# Altium project Actuator_Base_Board.PrjPcb
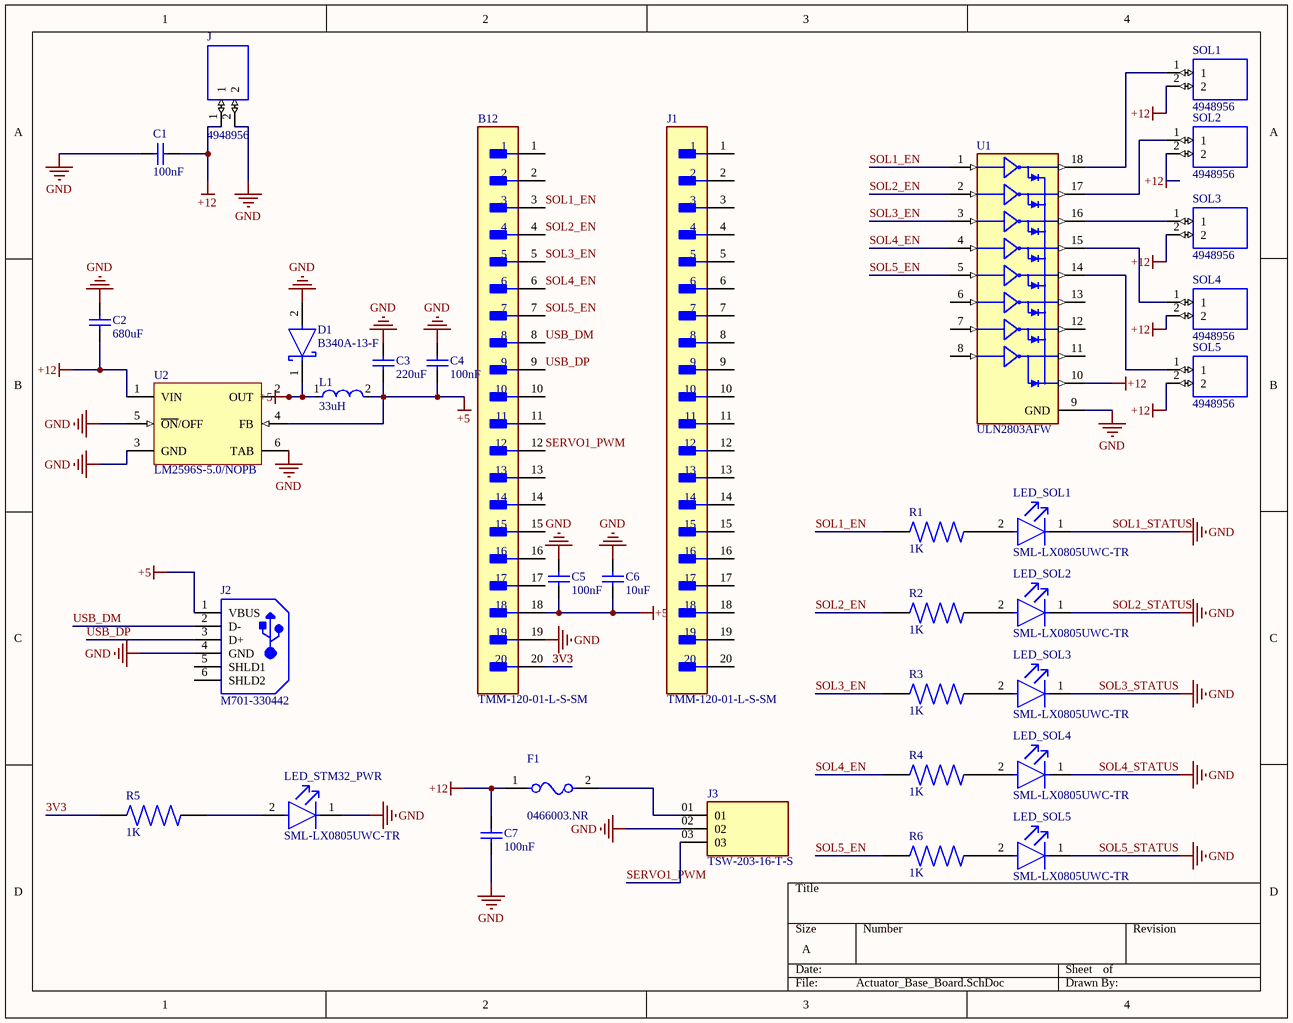
[diagram p0: Actuator_Base_Board.SchDoc]
1 sheet, 34 parts. Net scope: global (net labels, ports and power ports of the same name join across sheets).
Board file: Actuator_Base_Board.PcbDoc

## Sheet Actuator_Base_Board.SchDoc
size A; SheetNumber: 1; SheetTotal: 1

### Parts
B12  TMM-120-01-L-S-SM  [FP-TMM-120-01-L-S-SM-MFG]
C1  100nF  [CAPC2013X145X48LL20T23]
C2  680uF  [CAPC2013X145X48LL20T23]
C3  220uF  [CAPC2013X145X48LL20T23]
C4  100nF  [CAPC2013X145X48LL20T23]
C5  100nF  [CAPC2013X145X48LL20T23]
C6  10uF  [CAPC2013X145X48LL20T23]
C7  100nF  [CAPC2013X145X48LL20T23]
D1  B340A-13-F  [FP-SMA-MFG]
F1  0466003.NR  [FP-0466-MFG]
J  4948956  [SHDR2W100P0X500_1X2_1000X750X1]
J1  TMM-120-01-L-S-SM  [FP-TMM-120-01-L-S-SM-MFG]
J2  M701-330442  [HRWN-M701-330442_V]
J3  TSW-203-16-T-S  [SAMTEC_TSW-203-16-T-S]
L1  33uH  [FP-NR4018-MFG]
LED_SOL1  SML-LX0805UWC-TR  [FP-SML-LX0805UWC-TR-MFG]
LED_SOL2  SML-LX0805UWC-TR  [FP-SML-LX0805UWC-TR-MFG]
LED_SOL3  SML-LX0805UWC-TR  [FP-SML-LX0805UWC-TR-MFG]
LED_SOL4  SML-LX0805UWC-TR  [FP-SML-LX0805UWC-TR-MFG]
LED_SOL5  SML-LX0805UWC-TR  [FP-SML-LX0805UWC-TR-MFG]
LED_STM32_PWR  SML-LX0805UWC-TR  [FP-SML-LX0805UWC-TR-MFG]
R1  1K  [RES_ERJU02F1543X]
R2  1K  [RES_ERJU02F1543X]
R3  1K  [RES_ERJU02F1543X]
R4  1K  [RES_ERJU02F1543X]
R5  1K  [RES_ERJU02F1543X]
R6  1K  [RES_ERJU02F1543X]
SOL1  4948956  [SHDR2W100P0X500_1X2_1000X750X1]
SOL2  4948956  [SHDR2W100P0X500_1X2_1000X750X1]
SOL3  4948956  [SHDR2W100P0X500_1X2_1000X750X1]
SOL4  4948956  [SHDR2W100P0X500_1X2_1000X750X1]
SOL5  4948956  [SHDR2W100P0X500_1X2_1000X750X1]
U1  ULN2803AFW  [SOIC127P1030X265-18N]
U2  LM2596S-5.0/NOPB  [KTT0005B_L]

### Nets
+5: B12.18 C3.2 C4.1 C5.1 C6.1 D1.1(C) J2.1(VBUS) L1.1 L1.2 U2.2(OUT) U2.4(FB)
+12: C1.1 C2.1 C7.2 F1.1 J.1 SOL1.2 SOL2.2 SOL3.2 SOL4.2 SOL5.2 U1.10(COMMON) U2.1(VIN)
SOL1_STATUS: B12.19 C1.2 C2.2 C3.1 C4.2 C5.2 C6.2 C7.1 D1.2(A) J.2 J2.4(GND) J3.02 LED_SOL1.1(C) LED_SOL2.1(C) LED_SOL3.1(C) LED_SOL4.1(C) LED_SOL5.1(C) LED_STM32_PWR.1(C) U1.9(GND) U2.3(GND) U2.5(~{ON}/OFF) U2.6(TAB)  [also labelled GND, SOL2_STATUS, SOL3_STATUS, SOL4_STATUS, SOL5_STATUS]
3V3: B12.20 R5.1
SERVO1_PWM: B12.12 J3.03
SOL1_EN: B12.3 R1.1 U1.1(I1)
SOL2_EN: B12.4 R2.1 U1.2(I2)
SOL3_EN: B12.5 R3.1 U1.3(I3)
SOL4_EN: B12.6 R4.1 U1.4(I4)
SOL5_EN: B12.7 R6.1 U1.5(I5)
USB_DM: B12.8 J2.2(D-)
USB_DP: B12.9 J2.3(D+)
NetF1_2: F1.2 J3.01
NetLED_SOL1_2: LED_SOL1.2(A) R1.2
NetLED_SOL2_2: LED_SOL2.2(A) R2.2
NetLED_SOL3_2: LED_SOL3.2(A) R3.2
NetLED_SOL4_2: LED_SOL4.2(A) R4.2
NetLED_SOL5_2: LED_SOL5.2(A) R6.2
NetLED_STM32_PWR_2: LED_STM32_PWR.2(A) R5.2
NetSOL1_1: SOL1.1 U1.18(O1)
NetSOL2_1: SOL2.1 U1.17(O2)
NetSOL3_1: SOL3.1 U1.16(O3)
NetSOL4_1: SOL4.1 U1.15(O4)
NetSOL5_1: SOL5.1 U1.14(O5)

Not connected (* = marked no-connect by the designer): B12 1 2 10 11 13 14 15 16 17; J1 1 2 3 4 5 6 7 8 9 10 11 12 13 14 15 16 17 18 19 20; J2 5(SHLD1) 6(SHLD2); U1 6(I6) 7(I7) 8(I8) 11(O8) 12(O7) 13(O6)

### Library data of the parts
B12 J1 = CMP-02766-001494-1: 2MM TERMINAL STRIP; Connector Type: Header; Gender: Male; Number of Positions: 20; Contact Type: Male Pin; Min Operating Temperature: -55°C; Max Operating Temperature: 125°C; Flammability Rating: UL94 V-0; REACH SVHC: No SVHC; Lead Free: Lead Free; Fastening Type: Pull; Mount: Surface Mount; Contact Plating: Gold; Contact Finish - Mating: GOLD; Insulation Material: Polymer; Number of Contacts: 20; Insulation Color: Black; Contact Shape: Square; Termination: Solder; Number of Rows: 1; Series: TMM; Packaging: Rail/Tube; Contact Material: Bronze
C1-C7 = CMP-2007-03205-1: Manufacturer: Vitramon; Part Number: VJ0805Y682KXAMT
D1 = CMP-1667-00003-3: DIODE SCHOTTKY 40V 3A SMA; Max Forward Surge Current (Ifsm): 80A; Forward Voltage: 500mV; Polarity: Standard; Max Reverse Current: 500uA; Capacitance: 250pF; Element Configuration: Single; Mount: Surface Mount; Output Current: 3A; Radiation Hardening: No; Width: 2.92mm; Current Rating: 3A; Termination: SMD/SMT; Voltage: 40V; Series: -; Max Operating Temperature: 125°C; Current: 3A; Max Repetitive Reverse Voltage (Vrrm): 40V; Min Operating Temperature: -55°C; REACH SVHC: No SVHC; Number of Pins: 2; Average Rectified Current: 3A; Contact Plating: Tin; RoHS Compliant: Yes; Max Reverse Voltage (DC): 40V; Packaging: Tape and Reel; Height: 2.3mm; Length: 4.6mm; Case/Package: SMA; Weight: 0.002258oz; Peak Non-Repetitive Surge Current: 80A; Package Quantity: 5000; Lead Free: Lead Free; Forward Current: 3A; Voltage Rating (DC): 40V
F1 = CMP-08605-000054-1_1: FUSE BOARD MNT 3A 32VAC/VDC 1206; Manufacturer: Littelfuse; Fuse Interrupt Ac Current: 50A; Fuse Voltage Drop: 75.99mV; Max Fuse Ac Voltage: 32V; Fuse I2T: 0.576A2Sec; Resistance: 0.019Ω; Fuse Blow Speed: Fast; Value: 0.019Ω; ComponentLink2Description: Datasheet; Fuse Current: 3A; RoHS: TRUE; Mouser Description: Surface Mount Fuses 32V 3A VFA Slimline; Height: 0.66mm; Octopart: https://octopart.com/0466003.nr-littelfuse-565175; Package: 0466; Fuse Interrupt Dc Current: 50A; Manufacturer Part Number: 0466003.NR; Temperature Range Low: -55°C; ComponentLink2URL: https://www.littelfuse.com/~/media/electronics/datasheets/fuses/littelfuse_fuse_466_datasheet.pdf.pdf; Digikey Description: FUSE BOARD MNT 3A 32VAC/VDC 1206; Voltage Rating: 32V; Category: Fuse; Lead Free: Yes; Device Class L2: Fuses; Automotive: No; Max Fuse Dc Voltage: 32V; Temperature Range High: +90°C; Device Class L3: unset; Device Class L1: Circuit Protection; Temperature: -55°C to +90°C
J SOL1-SOL5 = 4948956: 5.08mm Pitch Straight PCB Terminal Block with Screw Term.; Through Hole; 2 Way; MF: RS Pro; MP: 4948956; Value: *; Package: None; SnapEDA_Link: https://www.snapeda.com/parts/4948956/RS%20Pro/view-part/1278850/?ref=snap; Price: None; Availability: Unavailable
J2 = CMP-1752-00001-1: Single USB 2.0, Receptacle Connecter, B Type, 4 Position Through Hole, -55 to 85 degC, RoHS, Tray; DatasheetVersion: Oct-15; PackageDescription: USB Connecter, 4 Position Through Hole, Length 12.04 mm, Height 16.25 mm, Tail Length 3.1 mm; PackageReference: M701-330442; ComponentLink1Description: Datasheet; ComponentLink1URL: https://cdn.harwin.com/pdfs/M701-330442.pdf
L1 = CMP-14484-001019-1: SMD Power Inductors 220uH ±20% 0.17A 4.56Ω; Shielding: Shielded; DC Resistance (DCR): 4.56R; Current Rating: 170mA; Core Material: Ferrite; Saturation Current: 275mA; Self Resonant Frequency: 4MHz; Test Frequency: 100kHz; Width: 0.157inch; Mount: Surface Mount; Max Operating Temperature: 125°C; Length: 0.157inch; RoHS Compliant: Yes; Min Operating Temperature: -25°C; Case/Package: Nonstandard; Resistor Type: Wirewound; Height - Seated (Max): 0.071inch; Tolerance: 20%; Inductance: 220uH; Packaging: Tape and Reel
LED_SOL1-LED_SOL5 LED_STM32_PWR = CMP-00229-00139794-1: SML-LX0805UWC-TR White LED, 0805 Diffused, Rectangle Lens SMD package | Lumex SML-LX0805UWC-TR; NexarPartId: 139794; Approvals: CSA, UL; Lens Color: Clear, Yellow; Luminous Intensity: 150mcd; Power Rating: 120mW; Forward Current: 20mA; Forward Voltage: 3.5V; Number of LEDs: 1; Viewing Angle: 120°; RoHS: Compliant; Case/Package: 0805; Illumination Color: White; Min Operating Temperature: -40°C; Mount: Surface Mount; Max Operating Temperature: 85°C
R1-R6 = ERJU02F1543X: Value: *; Availability: Unavailable; Price: None; Package: None; MP: ERJU02F1543X
U1 = ULN2803AFW: Bipolar (BJT) Transistor Array 8 NPN Darlington 50V 500mA - 1.31W Surface Mount 18-SOP; MF: Toshiba; SnapEDA_Link: https://www.snapeda.com/parts/ULN2803AFW/Toshiba/view-part/?ref=snap; Package: SO-18 Toshiba; Value: *; MP: ULN2803AFW; Check_prices: https://www.snapeda.com/parts/ULN2803AFW/Toshiba/view-part/?ref=eda
U2 = CMP-0069-00269-3: SIMPLE SWITCHER® Power Converter 150 KHz 3A Step-Down Voltage Regulator, 5-pin TO-263, Pb-Free; Manufacturer: Texas Instruments; PowerWise: N; PackageTopMarking: NSUZXYTTE#*LM2596S*-5.0 P+; ComponentLink1URL: http://www.ti.com/general/docs/lit/getliterature.tsp?genericPartNumber=LM2596&fileType=pdf; PackageDescription: TO-263, Molded, .400 x .390 x .180in, 5 Lead, .067in Pitch, Surface Mount; RoHS: Y; PinCount: 5; Code_JEDEC: MO-169-AB; ComponentLink1Description: Datasheet URL; PackageReference: KTT0005B; CompType: Switcher
J3 = TSW-203-16-T-S: Package: None; Price: None; Value: *; MP: TSW-203-16-T-S; Availability: Unavailable